# Altium project Lora-IO-Device.PrjPCB
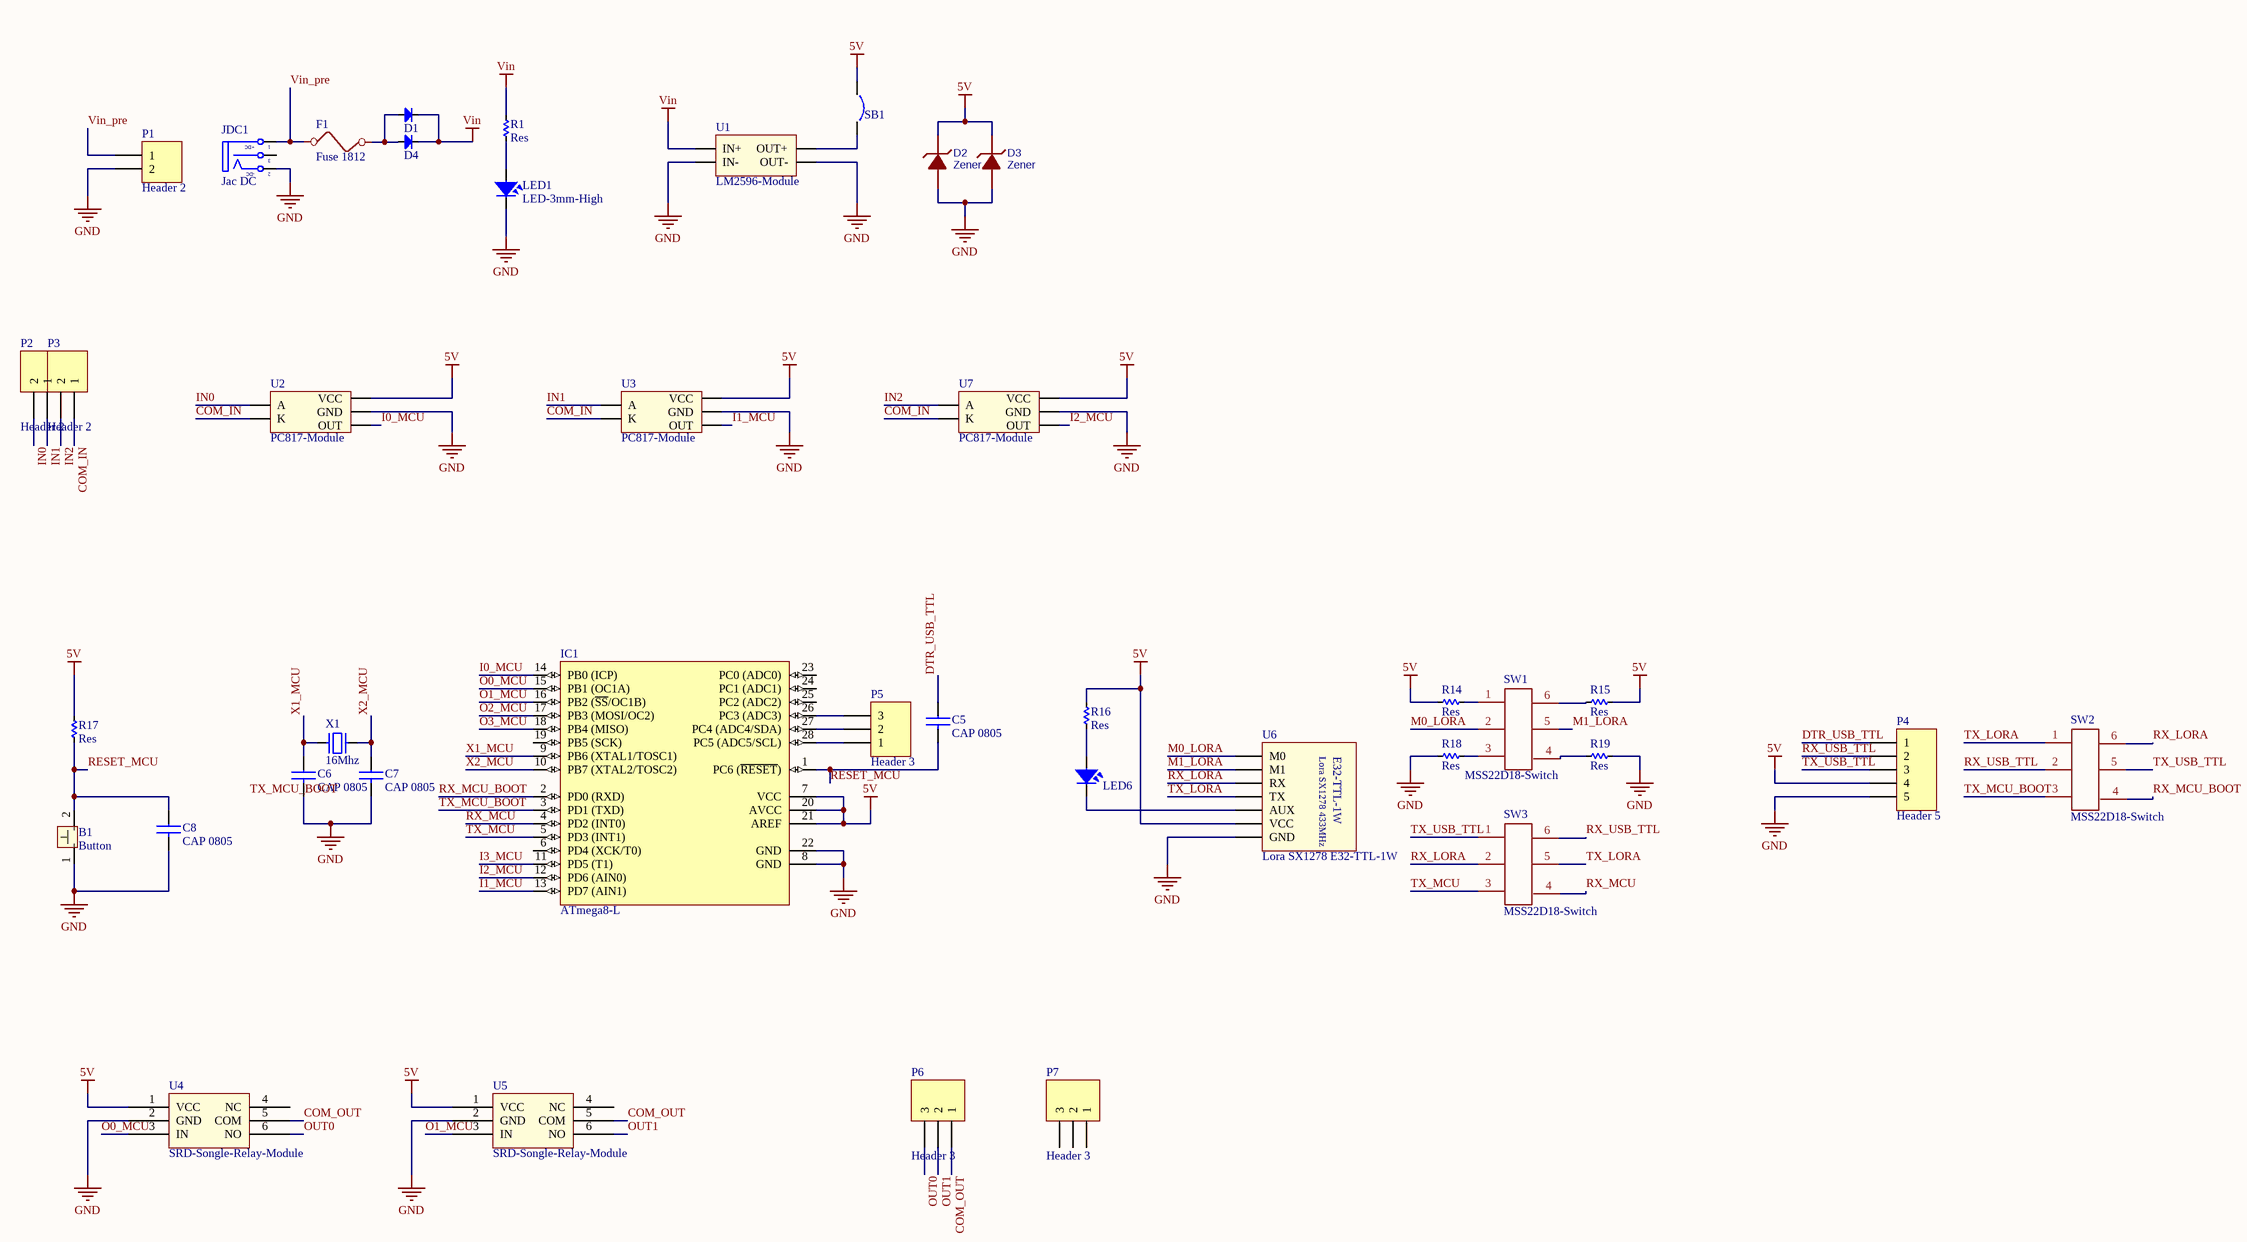
[diagram p0: Lora-IO-Device.SchDoc]
1 sheet, 40 parts. Net scope: global (net labels, ports and power ports of the same name join across sheets).
Board file: Lora-IO-Device.PcbDoc

## Sheet Lora-IO-Device.SchDoc
size A2

### Parts
B1  Button  [Button]
C5  CAP 0805  [0805]
C6  CAP 0805  [0805]
C7  CAP 0805  [0805]
C8  CAP 0805  [0805]
D1  Diode SMD  [DIO-SMD-106]  (value not drawn)
D2  Zener  [SOD80C]
D3  Zener  [SOD80C]
D4  Diode SMD  [DIO-SMD-106]  (value not drawn)
F1  Fuse 1812  [Fuse-1812]
IC1  ATmega8-L  [DIP28/W0.3]
JDC1  Jac DC  [DC0]
LED1  LED-3mm-High  [LED-3mm-High-Green]
LED6  LED  [LED-0805-Orange]  (value not drawn)
P1  Header 2  [TBlock 2]
P2  Header 2  [TBlock 2]
P3  Header 2  [TBlock 2]
P4  Header 5  [Header 5-V]
P5  Header 3  [TBlock 3]
P6  Header 3  [TBlock 3]
P7  Header 3  [TBlock 3]
R1  Res  [RES-SMD-0805]
R14  Res  [RES-SMD-0805]
R15  Res  [RES-SMD-0805]
R16  Res  [RES-SMD-0805]
R17  Res  [RES-SMD-0805]
R18  Res  [RES-SMD-0805]
R19  Res  [RES-SMD-0805]
SB1  Circuit-Shorter  [Circuit-Shorter]  (value not drawn)
SW1  MSS22D18-Switch  [MSS22D18-Switch-SMD]
SW2  MSS22D18-Switch  [MSS22D18-Switch-SMD]
SW3  MSS22D18-Switch  [MSS22D18-Switch-SMD]
U1  LM2596-Module  [LM2596-Module-2]
U2  PC817-Module  [PC817-Module-1]
U3  PC817-Module  [PC817-Module-1]
U4  SRD-Songle-Relay-Module  [SRD-Songle-Relay-Module-1]
U5  SRD-Songle-Relay-Module  [SRD-Songle-Relay-Module-1]
U6  Lora SX1278 E32-TTL-1W  [Lora SX1278 E32-TTL-1W]
U7  PC817-Module  [PC817-Module-1]
X1  16Mhz  [XTAL-RU49/4]

### Nets
5V: D2.2(K) D3.2(K) IC1.7(VCC) IC1.20(AVCC) IC1.21(AREF) P4.4 R14.2 R15.1 R16.1 R17.1 SB1.1 U2.3(VCC) U3.3(VCC) U4.1(VCC) U5.1(VCC) U6.6(VCC) U7.3(VCC)
GND: B1.1 C6.2 C7.2 C8.2 D2.1(A) D3.1(A) IC1.8(GND) IC1.22(GND) JDC1.2(TN) LED1.2(K) P1.2 P4.5 R18.2 R19.1 U1.IN- U1.OUT- U2.4(GND) U3.4(GND) U4.2(GND) U5.2(GND) U6.7(GND) U7.4(GND)
Vin: D1.2(K) D4.2(K) R1.1 U1.IN+
COM_IN: P3.1 U2.2(K) U3.2(K) U7.2(K)
COM_OUT: P6.1 U4.5(COM) U5.5(COM)
DTR_USB_TTL: C5.1 P4.1
I0_MCU: IC1.14(PB0_(ICP)) U2.5(OUT)
I1_MCU: IC1.13(PD7_(AIN1)) U3.5(OUT)
I2_MCU: IC1.12(PD6_(AIN0)) U7.5(OUT)
I3_MCU: IC1.11(PD5_(T1))
IN0: P2.2 U2.1(A)
IN1: P2.1 U3.1(A)
IN2: P3.2 U7.1(A)
M0_LORA: SW1.2 U6.1(M0)
M1_LORA: SW1.5 U6.2(M1)
O0_MCU: IC1.15(PB1_(OC1A)) U4.3(IN)
O1_MCU: IC1.16(PB2_(~{SS}/OC1B)) U5.3(IN)
O2_MCU: IC1.17(PB3_(MOSI/OC2))
O3_MCU: IC1.18(PB4_(MISO))
OUT0: P6.3 U4.6(NO)
OUT1: P6.2 U5.6(NO)
RESET_MCU: B1.2 C5.2 C8.1 IC1.1(PC6_(~{RESET})) R17.2
RX_LORA: SW2.6 SW3.2 U6.3(RX)
RX_MCU: IC1.4(PD2_(INT0)) SW3.4
RX_MCU_BOOT: IC1.2(PD0_(RXD)) SW2.4
RX_USB_TTL: P4.2 SW2.2 SW3.6
TX_LORA: SW2.1 SW3.5 U6.4(TX)
TX_MCU: IC1.5(PD3_(INT1)) SW3.3
TX_MCU_BOOT: IC1.3(PD1_(TXD)) SW2.3
TX_USB_TTL: P4.3 SW2.5 SW3.1
Vin_pre: F1.1 JDC1.1(T) P1.1
X1_MCU: C6.1 IC1.9(PB6_(XTAL1/TOSC1)) X1.1
X2_MCU: C7.1 IC1.10(PB7_(XTAL2/TOSC2)) X1.2
NetD1_1: D1.1(A) D4.1(A) F1.2
NetIC1_26: IC1.26(PC3_(ADC3)) P5.3
NetIC1_27: IC1.27(PC4_(ADC4/SDA)) P5.2
NetIC1_28: IC1.28(PC5_(ADC5/SCL)) P5.1
NetLED1_1: LED1.1(A) R1.2
NetLED6_1: LED6.1 R16.2
NetLED6_2: LED6.2 U6.5(AUX)
NetR14_1: R14.1 SW1.1
NetR15_2: R15.2 SW1.6
NetR18_1: R18.1 SW1.3
NetR19_2: R19.2 SW1.4
NetSB1_2: SB1.2 U1.OUT+

Not connected (* = marked no-connect by the designer): IC1 6(PD4_(XCK/T0)) 19(PB5_(SCK)) 23(PC0_(ADC0)) 24(PC1_(ADC1)) 25(PC2_(ADC2)); JDC1 3(S); P7 1 2 3; U4 4(NC); U5 4(NC)

### Notes on the sheet
- Labels drawn without touching a wire or pin: TX_MCU_BOOT
- Title
- Size:
- Date:
- File:
- A2
- Number:
- Time:
- Revision:
- Sheet
- of
- (in symbol DCIN) +DC; -DC
- (in symbol Lora SX1278 E32-TTL-1W) Lora SX1278 433MHz; E32-TTL-1W

### Library data of the parts
B1 = Button: Button 6x6 SMD 4 pin
C5-C8 = CAP 0805: Right: 20; Bottom: 10
D1 D4 = Diode SMD: Default Diode; Code - JEDEC: DO-214-AB; Value: 1N5007; Published: 8-Jun-2000; Revision: July-2002: Re-released for DXP Platform.; Publisher: Altium Limited
D2 D3 = Zener: BOM_Manufacturer: NXP Semicon; BOM_Manufacturer Part: BZV55-C15; Contributor: LCSC; BOM_Supplier: LCSC; BOM_Supplier Part: C108433; spicePre: D
F1 = Fuse-1812
IC1 = ATmega8-L: 8-Bit AVR Microcontroller with 8K Bytes of In-System Programmable Flash Memory; Value: ATmega8-L
JDC1 = DCIN: Jac DC input; Value: Jac DC
LED6 = LED SMD: Value: LED 3 - 5 ly 2 Colour
P1-P3 = Header 2: Header, 2-Pin; LatestRevisionDate: 17-Jul-2002; LatestRevisionNote: Re-released for DXP Platform.; Publisher: Altium Limited
P4 = Header 5: Header, 5-Pin; LatestRevisionDate: 17-Jul-2002; LatestRevisionNote: Re-released for DXP Platform.; Publisher: Altium Limited
P5-P7 = Header 3: Header, 3-Pin; LatestRevisionDate: 17-Jul-2002; LatestRevisionNote: Re-released for DXP Platform.; Publisher: Altium Limited
R1 R14-R19 = Res-SMD: Resistor; Manufacturer: Generic Components; Class: Passive; Published: 08/06/2000; Publisher: Altium Hobart Technology Centre
SB1 = Circuit-Shorter: Solder: NO; Published: 24-Mar-1999; Revision: July-2002: Re-released for DXP Platform.; Publisher: Altium Limited
X1 = XT2: Crystal, 32.768 KHz, -40 to 85 degC, 3.2 x 1.5 x 0.9 mm SMD; Value: 4Mhz